# Altium project GPS_TR+GSM.PrjPCB
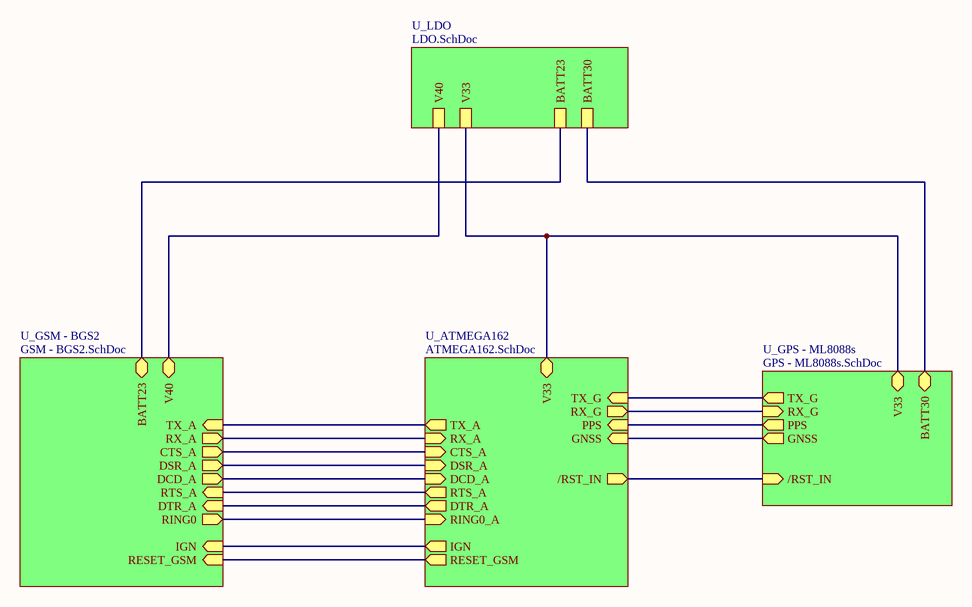
[diagram p0: GLOBAL.SchDoc]
5 sheets, 55 parts. Net scope: flat (ports and power ports of the same name join across sheets).
Board file: Plate.PcbDoc
Sheets:
  GLOBAL.SchDoc
    U_LDO = LDO.SchDoc
    U_ATMEGA162 = ATMEGA162.SchDoc
    U_GPS - ML8088s = GPS - ML8088s.SchDoc
    U_GSM - BGS2 = GSM - BGS2.SchDoc

## Sheet GLOBAL.SchDoc
size A4

### Sub-sheets
U_ATMEGA162 = ATMEGA162.SchDoc: RX_A (in), TX_A (out), RTS_A (out), CTS_A (in), DTR_A (out), DSR_A (in), DCD_A (in), RING0_A (in), V33 (bidir), TX_G (in), RX_G (out), GNSS (in), PPS (in), /RST_IN (out), RESET_GSM (out), IGN (out)
U_GPS - ML8088s = GPS - ML8088s.SchDoc: PPS (out), TX_G (out), RX_G (in), GNSS (out), /RST_IN (in), V33 (bidir), BATT30 (bidir)
U_GSM - BGS2 = GSM - BGS2.SchDoc: DTR_A (in), RTS_A (in), RX_A (out), TX_A (in), CTS_A (out), DSR_A (out), DCD_A (out), RING0 (out), RESET_GSM (in), V40 (bidir), IGN (in), BATT23 (bidir)
U_LDO = LDO.SchDoc: V33, V40, BATT23, BATT30

### Nets
(unnamed): sheet U_LDO/V33, sheet U_ATMEGA162/V33, sheet U_GPS - ML8088s/V33
(unnamed): sheet U_LDO/V40, sheet U_GSM - BGS2/V40
(unnamed): sheet U_LDO/BATT23, sheet U_GSM - BGS2/BATT23
(unnamed): sheet U_LDO/BATT30, sheet U_GPS - ML8088s/BATT30
(unnamed): sheet U_ATMEGA162/RX_A, sheet U_GSM - BGS2/RX_A
(unnamed): sheet U_ATMEGA162/TX_A, sheet U_GSM - BGS2/TX_A
(unnamed): sheet U_ATMEGA162/RTS_A, sheet U_GSM - BGS2/RTS_A
(unnamed): sheet U_ATMEGA162/CTS_A, sheet U_GSM - BGS2/CTS_A
(unnamed): sheet U_ATMEGA162/DTR_A, sheet U_GSM - BGS2/DTR_A
(unnamed): sheet U_ATMEGA162/DSR_A, sheet U_GSM - BGS2/DSR_A
(unnamed): sheet U_ATMEGA162/DCD_A, sheet U_GSM - BGS2/DCD_A
(unnamed): sheet U_ATMEGA162/RING0_A, sheet U_GSM - BGS2/RING0
(unnamed): sheet U_ATMEGA162/TX_G, sheet U_GPS - ML8088s/TX_G
(unnamed): sheet U_ATMEGA162/RX_G, sheet U_GPS - ML8088s/RX_G
(unnamed): sheet U_ATMEGA162/GNSS, sheet U_GPS - ML8088s/GNSS
(unnamed): sheet U_ATMEGA162/PPS, sheet U_GPS - ML8088s/PPS
(unnamed): sheet U_ATMEGA162//RST_IN, sheet U_GPS - ML8088s//RST_IN
(unnamed): sheet U_ATMEGA162/RESET_GSM, sheet U_GSM - BGS2/RESET_GSM
(unnamed): sheet U_ATMEGA162/IGN, sheet U_GSM - BGS2/IGN

## Sheet LDO.SchDoc
size A4
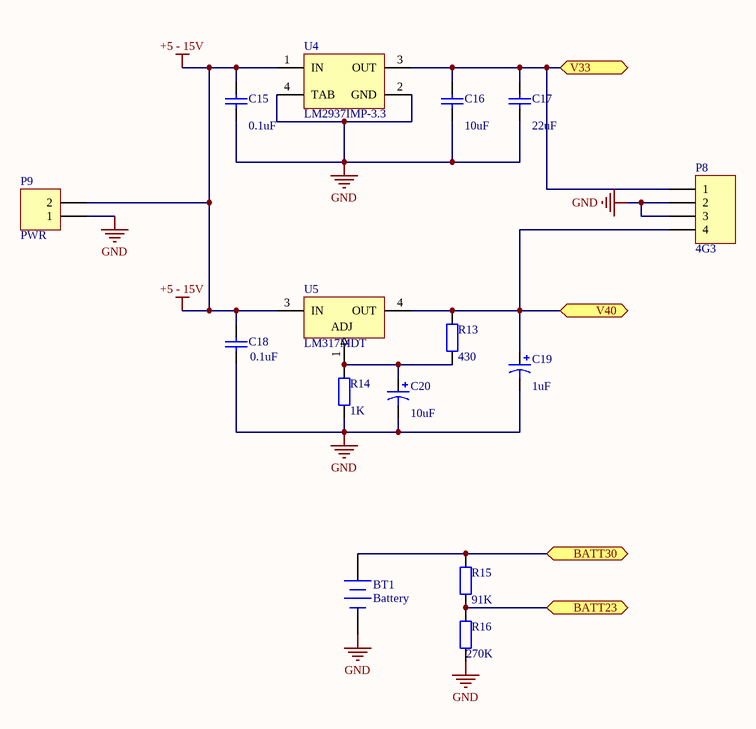
[diagram p1: LDO.SchDoc]

### Parts
BT1  Battery  [Edge Connector]
C15  value 0.1uF  [RAD-0.1]  (hidden comment: Cap)
C16  value 10uF  [R38]  (hidden comment: Cap)
C17  value 22uF  [R38]  (hidden comment: Cap)
C18  value 0.1uF  [RAD-0.1]  (hidden comment: Cap)
C19  value 1uF  [R38]  (hidden comment: Cap Pol1)
C20  value 10uF  [R38]  (hidden comment: Cap Pol1)
P8  4G3  [HDR1X4]
P9  PWR  [HDR1X2H]
R13  value 430  [AXIAL-0.4]  (hidden comment: Res2)
R14  value 1K  [AXIAL-0.4]  (hidden comment: Res2)
R15  value 91K  [AXIAL-0.4]  (hidden comment: Res2)
R16  value 270K  [AXIAL-0.4]  (hidden comment: Res2)
U4  LM2937IMP-3.3  [MP04A_N]
U5  LM317MDT  [TD03B_N]

### Ports
BATT23, BATT30, V33, V40

### Nets
+5 - 15V: C15.2 C18.2 P9.2 U4.1(IN) U5.3(IN)
GND: BT1.2(-) C15.1 C16.1 C17.1 C18.1 C19.2 C20.2 P8.2 P8.3 P9.1 R14.1 R16.1 U4.2(GND) U4.4(TAB)
NetBT1_1: BT1.1(+) R15.2 ; port BATT30
NetC4_1: C19.1 P8.4 R13.2 U5.4(OUT) ; port V40
NetC6_2: R15.1 R16.2 ; port BATT23
NetC12_1: C16.2 C17.2 P8.1 U4.3(OUT) ; port V33
NetC20_1: C20.1 R13.1 R14.2 U5.1(ADJ)

### Library data of the parts
BT1 = Battery: Multicell Battery; Published: 24-Mar-1999; LatestRevisionDate: 17-Jul-2002; LatestRevisionNote: Re-released for DXP Platform.; PackageReference: BAT-2; Publisher: Altium Limited; PackageDescription: Battery; 2 Leads
C15-C18 = Cap: Capacitor; Published: 8-Jun-2000; LatestRevisionDate: 17-Jul-2002; LatestRevisionNote: Re-released for DXP Platform.; PackageReference: RAD-0.3; Publisher: Altium Limited; PackageDescription: Radial Cap, Thru-Hole; 2 Leads; 0.3 in Pin Spacing
C19 C20 = Cap Pol1: Polarized Capacitor (Radial); Published: 8-Jun-2000; LatestRevisionDate: 17-Jul-2002; LatestRevisionNote: Re-released for DXP Platform.; PackageReference: RB7.6-15; Publisher: Altium Limited; PackageDescription: Polarized Capacitor (Radial); 2 Leads
P8 = Header 4H: Header, 4-Pin, Right Angle; LatestRevisionDate: 17-Jul-2002; LatestRevisionNote: Re-released for DXP Platform.; Publisher: Altium Limited
P9 = Header 2H: Header, 2-Pin, Right Angle; LatestRevisionDate: 17-Jul-2002; LatestRevisionNote: Re-released for DXP Platform.; Publisher: Altium Limited
R13-R16 = Res2: Resistor; Published: 8-Jun-2000; LatestRevisionDate: 17-Jul-2002; LatestRevisionNote: Re-released for DXP Platform.; PackageReference: AXIAL-0.4; Publisher: Altium Limited; PackageDescription: Axial Device, Thru-Hole; 2 Leads; 0.4 in Pin Spacing
U4 = LM2937IMP-3.3: 500 mA Low Dropout Regulator; Manufacturer: National Semiconductor; CompType: LDO IC; PackageTopMarking: XYTT*L69B; PowerWise: N; Published: 4-Dec-2008; DatasheetVersion: Aug-2005; PackageVersion: revB, Apr-2003; PackageReference: MP04A; Publisher: Altium Limited; PackageDescription: Molded SOT-223, 6.50 x 3.56 x 1.6mm Body, 4 Lead, 2.3mm Pitch; PartNumber: LM2937IMP-3.3; RoHS: O; PinCount: 4; DigiKeyPartNumber: LM2937IMP-3.3CT-ND; Code_JEDEC: TO-261-AA; Code_IPC: SOT223-4; ComponentLink1Description: LM2937-3.3 Datasheet; ComponentLink1URL: http://www.national.com/ds/LM/LM2937-3.3.pdf; ComponentLink2Description: LM2937-3.3 Web Page; ComponentLink2URL: http://www.national.com/pf/LM/LM2937-3.3.html; ComponentLink3Description: MP04A Package Page; ComponentLink3URL: http://www.national.com/packaging/folders/mp04a.html
U5 = LM317MDT: 3-Terminal Adjustable Regulator; Manufacturer: National Semiconductor; CompType: LDO IC; PackageTopMarking: NSUZXYTT*LM317*MDT; PowerWise: N; Published: 4-Dec-2008; DatasheetVersion: Apr-2007; PackageVersion: revC, Apr-2003; PackageReference: TD03B; Publisher: Altium Limited; PackageDescription: TO252, Molded, Jedec, 6.8 x 6.10 x 2.30mm Body, 3 Lead, 2.28mm Pitch, Surface Mount; PartNumber: LM317MDT; RoHS: O; PinCount: 3; DigiKeyPartNumber: LM317MDTNS-ND; Code_JEDEC: TO-252-AA; ComponentLink1Description: LM317 Datasheet; ComponentLink1URL: http://www.national.com/ds/LM/LM317.pdf; ComponentLink2Description: LM317 Web Page; ComponentLink2URL: http://www.national.com/pf/LM/LM317.html; ComponentLink3Description: TD03B Package Page; ComponentLink3URL: http://www.national.com/packaging/folders/td03b.html

## Sheet ATMEGA162.SchDoc
size A4
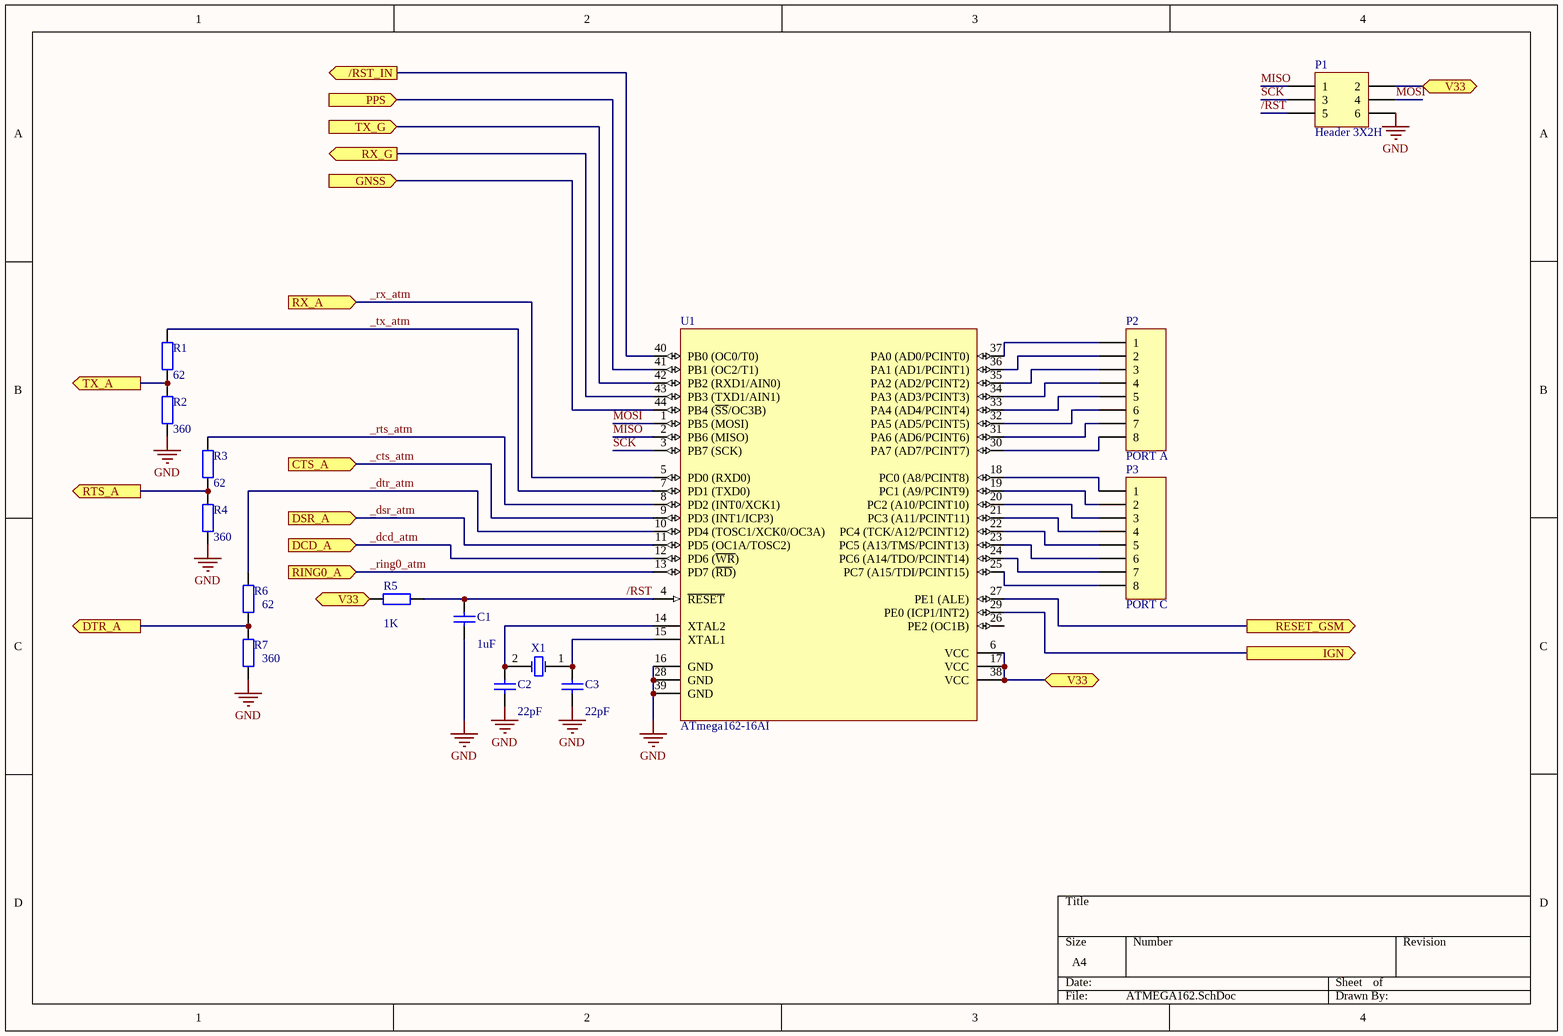
[diagram p2: ATMEGA162.SchDoc]

### Parts
C1  value 1uF  [RAD-0.1]  (hidden comment: Cap)
C2  value 22pF  [RAD-0.1]  (hidden comment: Cap)
C3  value 22pF  [RAD-0.1]  (hidden comment: Cap)
P1  Header 3X2H  [HDR2X3H]
P2  PORT A  [HDR1X8H]
P3  PORT C  [HDR1X8H]
R1  value 62  [AXIAL-0.4]  (hidden comment: Res2)
R2  value 360  [AXIAL-0.4]  (hidden comment: Res2)
R3  value 62  [AXIAL-0.4]  (hidden comment: Res2)
R4  value 360  [AXIAL-0.4]  (hidden comment: Res2)
R5  value 1K  [AXIAL-0.4]  (hidden comment: Res2)
R6  value 62  [AXIAL-0.4]  (hidden comment: Res2)
R7  value 360  [AXIAL-0.4]  (hidden comment: Res2)
U1  ATmega162-16AI  [44A_L]
X1  XTAL  [RAD-0.2]  (value not drawn)

### Ports
/RST_IN (out), CTS_A (in), DCD_A (in), DSR_A (in), DTR_A (out), GNSS (in), IGN (out), PPS (in), RESET_GSM (out), RING0_A (in), RTS_A (out), RX_A (in), RX_G (out), TX_A (out), TX_G (in), V33

### Nets
GND: C1.1 C2.1 C3.1 P1.6 R2.1 R4.1 R7.1 U1.16(GND) U1.28(GND) U1.39(GND)
/RST: C1.2 P1.5 R5.2 U1.4(~{RESET})
_cts_atm: U1.9(PD3_(INT1/ICP3)) ; port CTS_A
_dcd_atm: U1.12(PD6_(~{WR})) ; port DCD_A
_dsr_atm: U1.11(PD5_(OC1A/TOSC2)) ; port DSR_A
_dtr_atm: R6.2 U1.10(PD4_(TOSC1/XCK0/OC3A))
_ring0_atm: U1.13(PD7_(~{RD})) ; port RING0_A
_rts_atm: R3.2 U1.8(PD2_(INT0/XCK1))
_rx_atm: U1.5(PD0_(RXD0)) ; port RX_A
_tx_atm: R1.2 U1.7(PD1_(TXD0))
MISO: P1.1 U1.2(PB6_(MISO))
MOSI: P1.4 U1.1(PB5_(MOSI))
SCK: P1.3 U1.3(PB7_(SCK))
NetC2_2: C2.2 U1.14(XTAL2) X1.2(OSC2)
NetC3_2: C3.2 U1.15(XTAL1) X1.1(OSC1)
NetC12_1: P1.2 R5.1 U1.6(VCC) U1.17(VCC) U1.38(VCC) ; port V33
NetP2_1: P2.1 U1.37(PA0_(AD0/PCINT0))
NetP2_2: P2.2 U1.36(PA1_(AD1/PCINT1))
NetP2_3: P2.3 U1.35(PA2_(AD2/PCINT2))
NetP2_4: P2.4 U1.34(PA3_(AD3/PCINT3))
NetP2_5: P2.5 U1.33(PA4_(AD4/PCINT4))
NetP2_6: P2.6 U1.32(PA5_(AD5/PCINT5))
NetP2_7: P2.7 U1.31(PA6_(AD6/PCINT6))
NetP2_8: P2.8 U1.30(PA7_(AD7/PCINT7))
NetP3_1: P3.1 U1.18(PC0_(A8/PCINT8))
NetP3_2: P3.2 U1.19(PC1_(A9/PCINT9))
NetP3_3: P3.3 U1.20(PC2_(A10/PCINT10))
NetP3_4: P3.4 U1.21(PC3_(A11/PCINT11))
NetP3_5: P3.5 U1.22(PC4_(TCK/A12/PCINT12))
NetP3_6: P3.6 U1.23(PC5_(A13/TMS/PCINT13))
NetP3_7: P3.7 U1.24(PC6_(A14/TDO/PCINT14))
NetP3_8: P3.8 U1.25(PC7_(A15/TDI/PCINT15))
NetR1_1: R1.1 R2.2 ; port TX_A
NetR3_1: R3.1 R4.2 ; port RTS_A
NetR6_1: R6.1 R7.2 ; port DTR_A
NetR9_1: U1.29(PE0_(ICP1/INT2)) ; port IGN
NetR11_1: U1.27(PE1_(ALE)) ; port RESET_GSM
NetU1_40: U1.40(PB0_(OC0/T0)) ; port /RST_IN
NetU1_41: U1.41(PB1_(OC2/T1)) ; port PPS
NetU1_42: U1.42(PB2_(RXD1/AIN0)) ; port TX_G
NetU1_43: U1.43(PB3_(TXD1/AIN1)) ; port RX_G
NetU1_44: U1.44(PB4_(~{SS}/OC3B)) ; port GNSS

Not connected (* = marked no-connect by the designer): U1 26(PE2_(OC1B))

### Library data of the parts
C1-C3 = Cap: Capacitor; Published: 8-Jun-2000; LatestRevisionDate: 17-Jul-2002; LatestRevisionNote: Re-released for DXP Platform.; PackageReference: RAD-0.3; Publisher: Altium Limited; PackageDescription: Radial Cap, Thru-Hole; 2 Leads; 0.3 in Pin Spacing
P1 = Header 3X2H: Header, 3-Pin, Dual row, Right Angle; LatestRevisionDate: 17-Jul-2002; LatestRevisionNote: Re-released for DXP Platform.; Publisher: Altium Limited
P2 P3 = Header 8H: Header, 8-Pin, Right Angle; LatestRevisionDate: 17-Jul-2002; LatestRevisionNote: Re-released for DXP Platform.; Publisher: Altium Limited
R1-R7 = Res2: Resistor; Published: 8-Jun-2000; LatestRevisionDate: 17-Jul-2002; LatestRevisionNote: Re-released for DXP Platform.; PackageReference: AXIAL-0.4; Publisher: Altium Limited; PackageDescription: Axial Device, Thru-Hole; 2 Leads; 0.4 in Pin Spacing
U1 = ATmega162-16AI: 8-Bit AVR Microcontroller with 16K Bytes of In-System Programmable Flash Memory; Published: 17-Sep-2003; LatestRevisionDate: 13-Apr-2006; LatestRevisionNote: IPC-7351 Footprint Added.; DatasheetVersion: 2513C-AVR-09/02; PackageVersion: rev.B, Oct-2001; PackageReference: 44A; Publisher: Altium Limited; PackageDescription: 44-Pin Thin Quad Flat Pack 0.8 mm Pitch; ComponentLink1Description: Manufacturer Link; ComponentLink1URL: http://www.atmel.com; ComponentLink2Description: Datasheet; ComponentLink2URL: http://www.atmel.com/dyn/resources/prod_documents/doc2513.pdf; type: atmega162
X1 = XTAL: Crystal Oscillator; Published: 8-Jun-2000; LatestRevisionDate: 17-Jul-2002; LatestRevisionNote: Re-released for DXP Platform.; PackageReference: R38; Publisher: Altium Limited; PackageDescription: Crystal, Thru-Hole; 2 Leads; Body 3.1 x 8.2 mm (Dia.xH)

## Sheet GPS - ML8088s.SchDoc
size A4
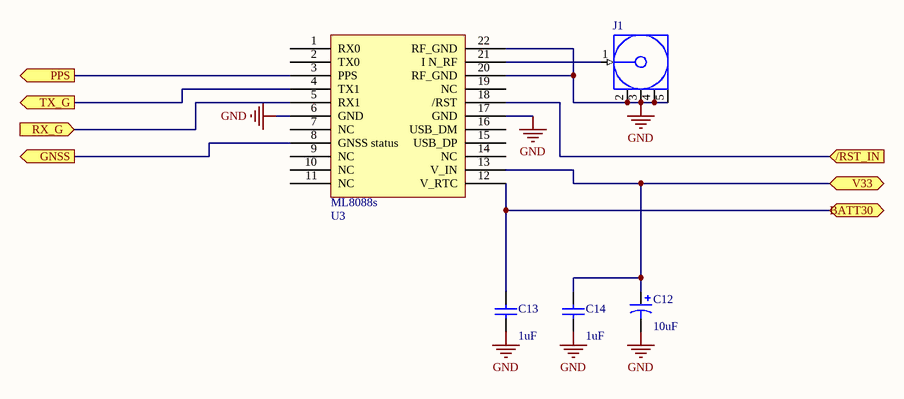
[diagram p3: GPS - ML8088s.SchDoc]

### Parts
C12  value 10uF  [R38]  (hidden comment: Cap Pol1)
C13  value 1uF  [RAD-0.1]  (hidden comment: Cap)
C14  value 1uF  [RAD-0.1]  (hidden comment: Cap)
J1  COAX-F  [MCX5.08-H5]  (value not drawn)
U3  Component_1  [LCCS127P1300X1500X280-22M]  (value not drawn)

### Ports
/RST_IN (in), BATT30 (bidir), GNSS (out), PPS (out), RX_G (in), TX_G (out), V33 (bidir)

### Nets
GND: C12.2 C13.1 C14.1 J1.2(GND) J1.3(GND) J1.4(GND) J1.5(GND) U3.6(GND) U3.17(GND) U3.20(RF_GND) U3.22(RF_GND)
NetBT1_1: C13.2 U3.12(V_RTC) ; port BATT30
NetC12_1: C12.1 C14.2 U3.13(V_IN) ; port V33
NetJ1_1: J1.1(Signal) U3.21(I_N_RF)
NetU1_40: U3.18(/RST) ; port /RST_IN
NetU1_41: U3.3(PPS) ; port PPS
NetU1_42: U3.4(TX1) ; port TX_G
NetU1_43: U3.5(RX1) ; port RX_G
NetU1_44: U3.8(GNSS_status) ; port GNSS

Not connected (* = marked no-connect by the designer): U3 1(RX0) 2(TX0) 7(NC) 9(NC) 10(NC) 11(NC) 14(NC) 15(USB_DP) 16(USB_DM) 19(NC)

### Notes on the sheet
- (in symbol Component_1) ML8088s

### Library data of the parts
C12 = Cap Pol1: Polarized Capacitor (Radial); Published: 8-Jun-2000; LatestRevisionDate: 17-Jul-2002; LatestRevisionNote: Re-released for DXP Platform.; PackageReference: RB7.6-15; Publisher: Altium Limited; PackageDescription: Polarized Capacitor (Radial); 2 Leads
C13 C14 = Cap: Capacitor; Published: 8-Jun-2000; LatestRevisionDate: 17-Jul-2002; LatestRevisionNote: Re-released for DXP Platform.; PackageReference: RAD-0.3; Publisher: Altium Limited; PackageDescription: Radial Cap, Thru-Hole; 2 Leads; 0.3 in Pin Spacing
J1 = COAX-F: RF Coaxial PCB Connector, MCX; Thru-Hole, Right-Angle Mount Socket, Blunt Post Terminal, 50 Ohm Impedance; PCB_Layout: Complies with manufacturer's recommendation.; DrillSize: Corresponds to nominal value.; Published: 15-Jul-2004; LatestRevisionDate: 15-Jul-2004; LatestRevisionNote: Component Replaced.; DatasheetDocument: 30-May-2003; PackageDocument: 04-Jul-1999; PackageReference: 919-119J-51AX; Publisher: Altium Limited; ComponentLink1Description: Manufacturer Link; ComponentLink1URL: http://www.amphenolrf.com/

## Sheet GSM - BGS2.SchDoc
size A4
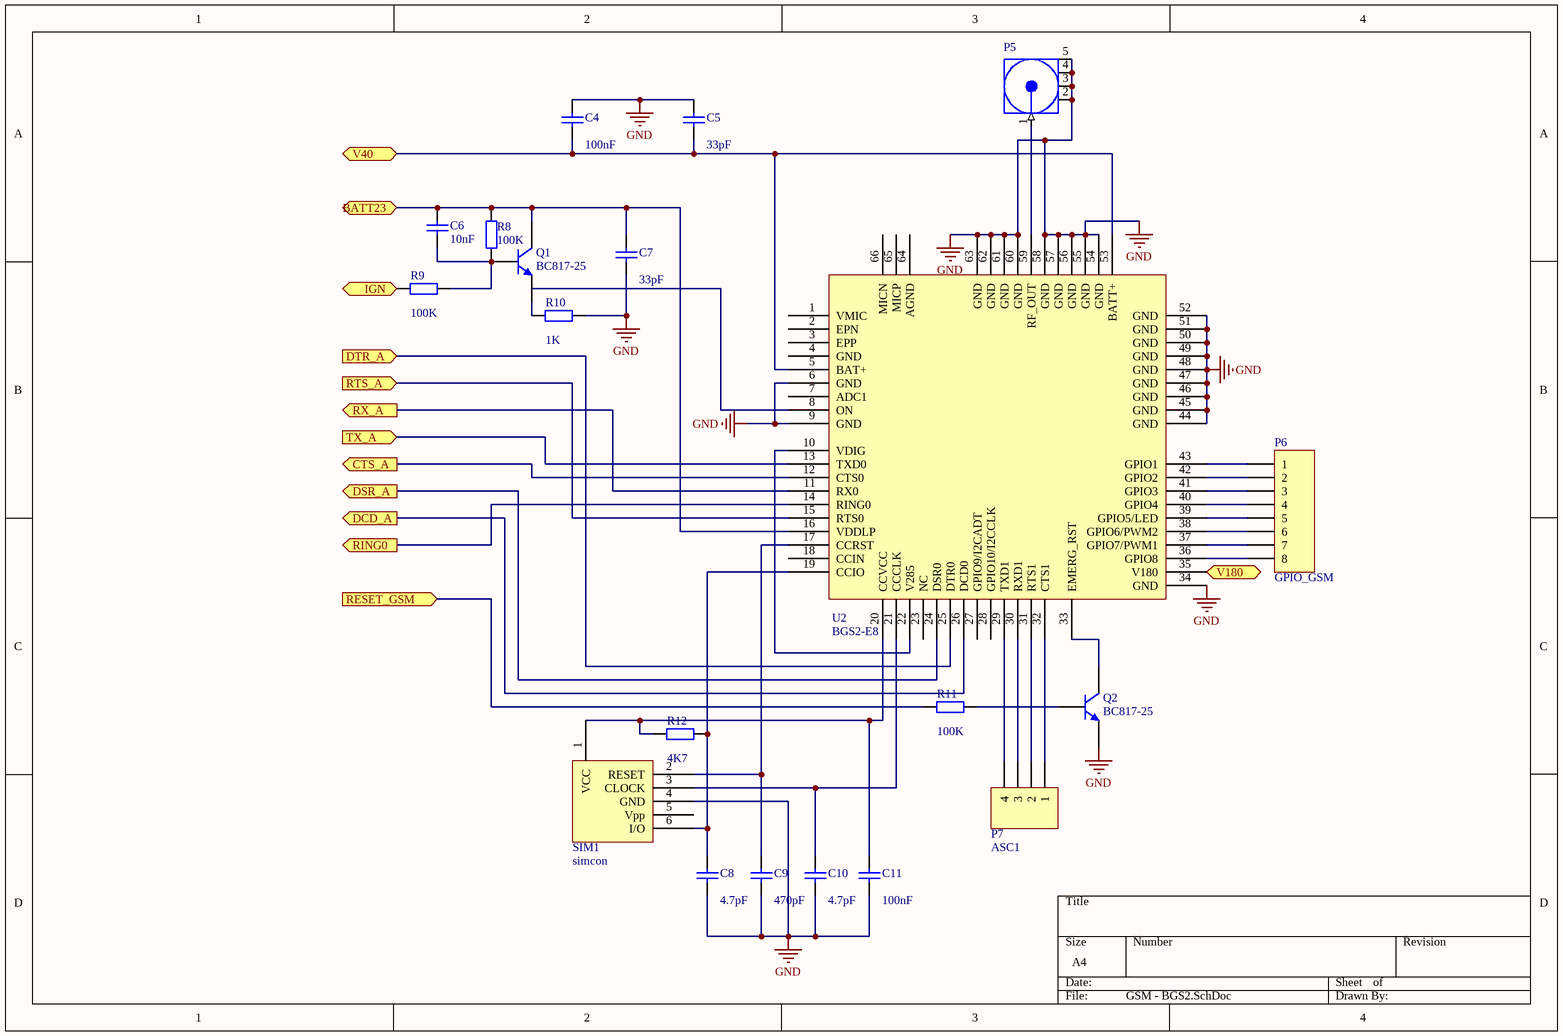
[diagram p4: GSM - BGS2.SchDoc]

### Parts
C4  value 100nF  [RAD-0.1]  (hidden comment: Cap)
C5  value 33pF  [RAD-0.1]  (hidden comment: Cap)
C6  value 10nF  [RAD-0.1]  (hidden comment: Cap)
C7  value 33pF  [RAD-0.1]  (hidden comment: Cap)
C8  value 4.7pF  [RAD-0.1]  (hidden comment: Cap)
C9  value 470pF  [RAD-0.1]  (hidden comment: Cap)
C10  value 4.7pF  [RAD-0.1]  (hidden comment: Cap)
C11  value 100nF  [RAD-0.1]  (hidden comment: Cap)
P5  COAX-M  [MCX5.08-H5]  (value not drawn)
P6  GPIO_GSM  [HDR1X8H]
P7  ASC1  [HDR1X4H]
Q1  BC817-25  [SOT-23A]
Q2  BC817-25  [SOT-23A]
R8  value 100K  [AXIAL-0.4]  (hidden comment: Res2)
R9  value 100K  [AXIAL-0.4]  (hidden comment: Res2)
R10  value 1K  [AXIAL-0.4]  (hidden comment: Res2)
R11  value 100K  [AXIAL-0.4]  (hidden comment: Res2)
R12  value 4K7  [AXIAL-0.4]  (hidden comment: Res2)
SIM1  simcon  [SIMCON-6pin]
U2  BGS2-E8  [QFN120P2700X1820X270-66M]

### Ports
BATT23, CTS_A (out), DCD_A (out), DSR_A (out), DTR_A (in), IGN (in), RESET_GSM (in), RING0 (out), RTS_A (in), RX_A (out), TX_A (in), V40, V180 (out)

### Nets
GND: C4.2 C5.2 C7.2 C8.1 C9.1 C10.1 C11.1 P5.2(GND) P5.3(GND) P5.4(GND) P5.5(GND) Q2.2(E) R10.2 SIM1.4(GND) U2.6(GND) U2.9(GND) U2.34(GND) U2.44(GND) U2.45(GND) U2.46(GND) U2.47(GND) U2.48(GND) U2.49(GND) U2.50(GND) U2.51(GND) U2.52(GND) U2.54(GND) U2.55(GND) U2.56(GND) U2.57(GND) U2.58(GND) U2.60(GND) U2.61(GND) U2.62(GND) U2.63(GND)
_cts_atm: U2.12(CTS0) ; port CTS_A
_dcd_atm: U2.26(DCD0) ; port DCD_A
_dsr_atm: U2.24(DSR0) ; port DSR_A
_rx_atm: U2.11(RX0) ; port RX_A
NetC4_1: C4.1 C5.1 U2.5(BAT+) U2.53(BATT+) ; port V40
NetC6_1: C6.1 Q1.1(B) R8.1 R9.2
NetC6_2: C6.2 C7.1 Q1.3(C) R8.2 U2.16(VDDLP) ; port BATT23
NetC8_2: C8.2 R12.2 SIM1.6(I/O) U2.19(CCIO)
NetC9_2: C9.2 SIM1.2(RESET) U2.17(CCRST)
NetC10_2: C10.2 SIM1.3(CLOCK) U2.21(CCCLK)
NetC11_2: C11.2 R12.1 SIM1.1(VCC) U2.20(CCVCC)
NetP5_1: P5.1(Signal) U2.59(RF_OUT)
NetP6_1: P6.1 U2.43(GPIO1)
NetP6_2: P6.2 U2.42(GPIO2)
NetP6_3: P6.3 U2.41(GPIO3)
NetP6_4: P6.4 U2.40(GPIO4)
NetP6_5: P6.5 U2.39(GPIO5/LED)
NetP6_6: P6.6 U2.38(GPIO6/PWM2)
NetP6_7: P6.7 U2.37(GPIO7/PWM1)
NetP6_8: P6.8 U2.36(GPIO8)
NetP7_1: P7.1 U2.32(CTS1)
NetP7_2: P7.2 U2.31(RTS1)
NetP7_3: P7.3 U2.30(RXD1)
NetP7_4: P7.4 U2.29(TXD1)
NetQ1_2: Q1.2(E) R10.1
NetQ2_1: Q2.1(B) R11.2
NetQ2_3: Q2.3(C) U2.33(EMERG_RST)
NetR1_1: U2.13(TXD0) ; port TX_A
NetR3_1: U2.15(RTS0) ; port RTS_A
NetR6_1: U2.25(DTR0) ; port DTR_A
NetR9_1: R9.1 ; port IGN
NetR11_1: R11.1 ; port RESET_GSM
NetU2_10: U2.10(VDIG) U2.22(V285)
NetU2_14: U2.14(RING0) ; port RING0
NetU2_35: U2.35(V180) ; port V180

Not connected (* = marked no-connect by the designer): SIM1 5(Vpp); U2 1(VMIC) 2(EPN) 3(EPP) 4(GND) 7(ADC1) 8(ON) 18(CCIN) 23(NC) 27(GPIO9/I2CADT) 28(GPIO10/I2CCLK) 64(AGND) 65(MICP) 66(MICN)

### Library data of the parts
C4-C11 = Cap: Capacitor; Published: 8-Jun-2000; LatestRevisionDate: 17-Jul-2002; LatestRevisionNote: Re-released for DXP Platform.; PackageReference: RAD-0.3; Publisher: Altium Limited; PackageDescription: Radial Cap, Thru-Hole; 2 Leads; 0.3 in Pin Spacing
P5 = COAX-M: RF Coaxial PCB Connector, MMCX; Thru-Hole, Vertical Mount Plug,  50 Ohm Impedance; PackageDocument: Rev. A, 16-Jun-1997; PCB_Layout: Complies with manufacturer's recommendation.; DrillSize: Corresponds to nominal value.; Published: 15-Jul-2004; LatestRevisionDate: 15-Jul-2004; LatestRevisionNote: Component Replaced.; DatasheetDocument: 30-May-2003; PackageReference: 908-21103; Publisher: Altium Limited; ComponentLink1Description: Manufacturer Link; ComponentLink1URL: http://www.amphenolrf.com/
P6 = Header 8H: Header, 8-Pin, Right Angle; LatestRevisionDate: 17-Jul-2002; LatestRevisionNote: Re-released for DXP Platform.; Publisher: Altium Limited
P7 = Header 4H: Header, 4-Pin, Right Angle; LatestRevisionDate: 17-Jul-2002; LatestRevisionNote: Re-released for DXP Platform.; Publisher: Altium Limited
Q1 Q2 = BC817-25: NPN General Purpose Amplifier; Published: 8-Jun-2000; LatestRevisionDate: 17-Jul-2002; LatestRevisionNote: Re-released for DXP Platform.; DatasheetDocument: 1997; PackageDocument: Sep-1998; PackageReference: SOT-23A; Publisher: Altium Limited; ComponentLink1Description: Manufacturer Link; ComponentLink1URL: http://www.fairchildsemi.com/; ComponentLink2Description: Discontinuation Notice; ComponentLink2URL: http://www.fairchildsemi.com/obsolete/obs.jsp
R8-R12 = Res2: Resistor; Published: 8-Jun-2000; LatestRevisionDate: 17-Jul-2002; LatestRevisionNote: Re-released for DXP Platform.; PackageReference: AXIAL-0.4; Publisher: Altium Limited; PackageDescription: Axial Device, Thru-Hole; 2 Leads; 0.4 in Pin Spacing

## Nets that join several sheets
GND: LDO (14 pins), ATMEGA162 (10 pins), GPS - ML8088s (11 pins), GSM - BGS2 (35 pins)
_cts_atm: ATMEGA162 (U1.9), GSM - BGS2 (U2.12)
_dcd_atm: ATMEGA162 (U1.12), GSM - BGS2 (U2.26)
_dsr_atm: ATMEGA162 (U1.11), GSM - BGS2 (U2.24)
_rx_atm: ATMEGA162 (U1.5), GSM - BGS2 (U2.11)
NetBT1_1: LDO (BT1.1 R15.2), GPS - ML8088s (C13.2 U3.12)
NetC4_1: LDO (C19.1 P8.4 R13.2 U5.4), GSM - BGS2 (C4.1 C5.1 U2.5 U2.53)
NetC6_2: LDO (R15.1 R16.2), GSM - BGS2 (5 pins)
NetC12_1: LDO (C16.2 C17.2 P8.1 U4.3), ATMEGA162 (5 pins), GPS - ML8088s (C12.1 C14.2 U3.13)
NetR1_1: ATMEGA162 (R1.1 R2.2), GSM - BGS2 (U2.13)
NetR3_1: ATMEGA162 (R3.1 R4.2), GSM - BGS2 (U2.15)
NetR6_1: ATMEGA162 (R6.1 R7.2), GSM - BGS2 (U2.25)
NetR9_1: ATMEGA162 (U1.29), GSM - BGS2 (R9.1)
NetR11_1: ATMEGA162 (U1.27), GSM - BGS2 (R11.1)
NetU1_40: ATMEGA162 (U1.40), GPS - ML8088s (U3.18)
NetU1_41: ATMEGA162 (U1.41), GPS - ML8088s (U3.3)
NetU1_42: ATMEGA162 (U1.42), GPS - ML8088s (U3.4)
NetU1_43: ATMEGA162 (U1.43), GPS - ML8088s (U3.5)
NetU1_44: ATMEGA162 (U1.44), GPS - ML8088s (U3.8)